# EAGLE design IND_DCDC (EAGLE 5.11)
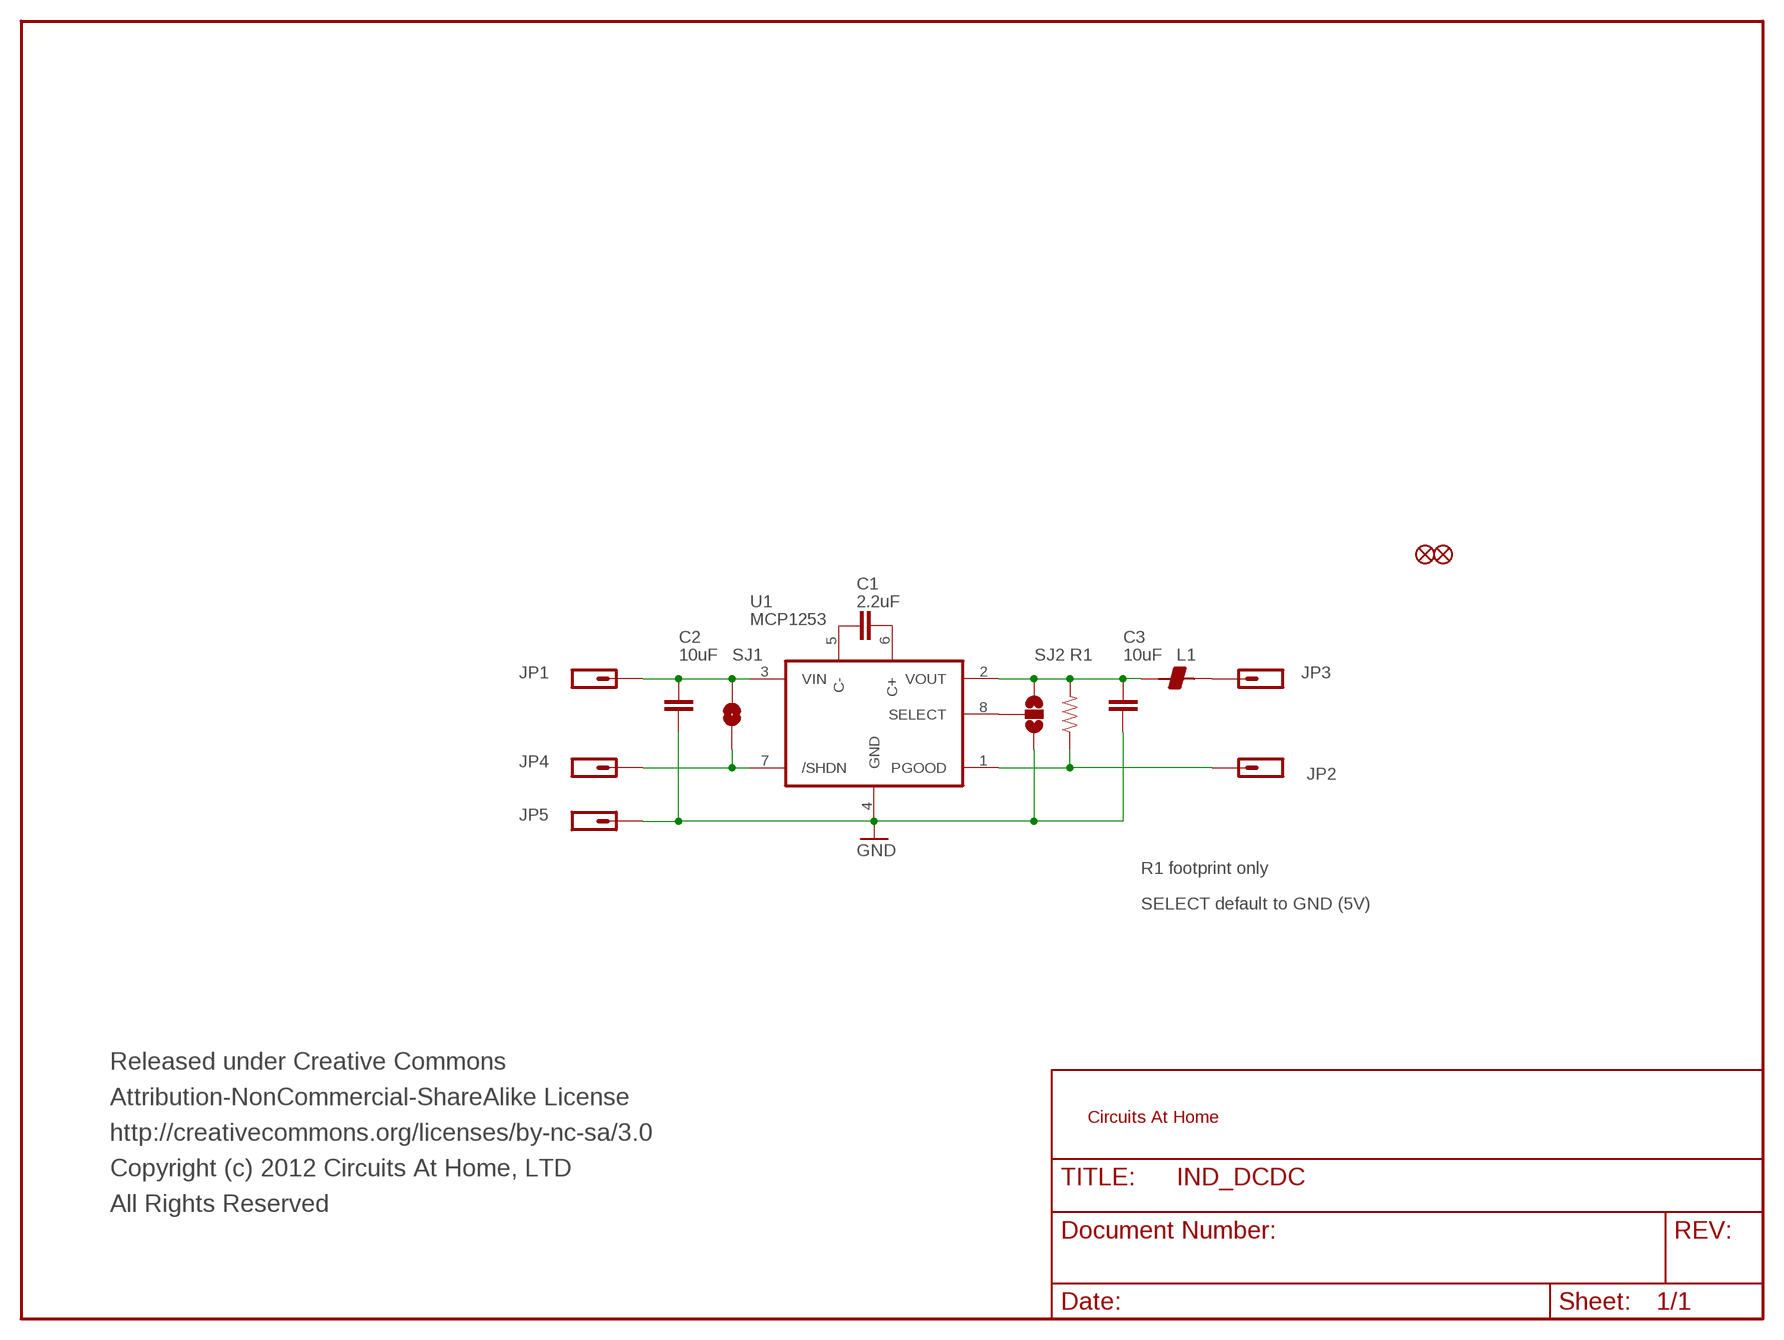
[diagram p0: schematic, sheet 1]

## Parts
C1  2.2uF  CAP0603  [0603]
C2  10uF  CAP0603  [0603]
C3  10uF  CAP0603  [0603]
JP1  M01PTH  [1X01]
JP2  M01PTH  [1X01]
JP3  M01PTH  [1X01]
JP4  M01PTH  [1X01]
JP5  M01PTH  [1X01]
JP6  FIDUCIAL1X2  [FIDUCIAL-1X2]
JP7  FIDUCIAL1X2  [FIDUCIAL-1X2]
L1  BEAD-0805  [0805]
R1  RESISTOR0603  [0603]
SJ1  SOLDERJUMPERTRACE  [SJ_2S-TRACE]
SJ2  SOLDERJUMPER_2WAYPASTE2&3  [SJ_3_PASTE2&3]
U1  MCP1253  [MSOP8]

## Nets
GND: C2.1 C3.1 JP5.1 SJ2.3 U1.4(GND)
N$1: C1.1 U1.5(C-)
N$2: C1.2 U1.6(C+)
N$3: C2.2 JP1.1 SJ1.2 U1.3(VIN)
N$4: JP4.1 SJ1.1 U1.7(/SHDN)
N$5: SJ2.2 U1.8(SELECT)
N$6: C3.2 L1.1 R1.2 SJ2.1 U1.2(VOUT)
N$7: JP2.1 R1.1 U1.1(PGOOD)
N$8: JP3.1 L1.2

## Notes on the sheet
- R1 footprint only
- SELECT default to GND (5V)
- Released under Creative Commons
- Attribution-NonCommercial-ShareAlike License
- http://creativecommons.org/licenses/by-nc-sa/3.0
- Copyright (c) 2012 Circuits At Home, LTD
- All Rights Reserved

## Library data of the parts
C1-C3 = CH_passive:CAP: Capacitor Standard 0603 ceramic capacitor, and 0.1" leaded capacitor.
JP1-JP5 = CH_connectors:M01: Header 1 Standard 1-pin 0.1" header. Use with straight break away headers (SKU : PRT-00116), right angle break away headers (PRT-00553), swiss pins (PRT-00743), machine pins (PRT-00117), and female headers (PRT-00115).
JP6 JP7 = CH_connectors:FIDUCIAL: Fiducial Alignment Points Various fiducial points for machine vision alignment.
L1 = CH_passive:BEAD
R1 = CH_passive:RESISTOR: Resistor Basic schematic elements and footprints for 0603, 1206, and PTH 1/10th watt (small) resistors.
SJ1 = CH_connectors:SOLDERJUMPER: Solder Jumper Standard SMD solder jumper. Used to automate production. Two varients : Normally Open and Normally Closed are the same, but have different paste layers. NC will have a large amount of paste and should jumper during reflow.
SJ2 = CH_connectors:SOLDERJUMPER_2WAY: Solder Jumper 2 way solder jumper
U1 = CH_Microchip:MCP1253

## Board
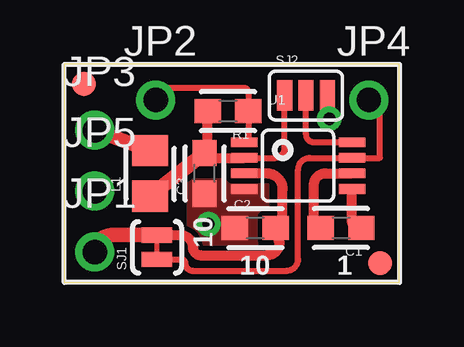
[diagram p1: board, top side]
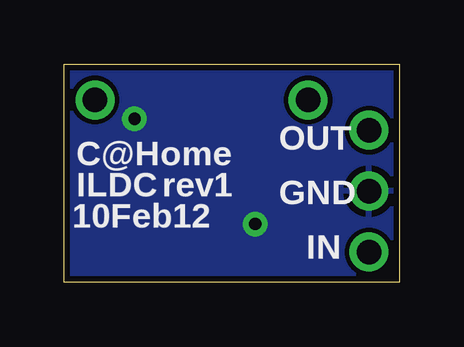
[diagram p2: board, bottom side, seen from below]

Size 13.97 x 9.1 mm. Coordinates in mm from the lower left corner, seen from the top.
Outline: 0,0 13.97,0 13.97,9.1 0,9.1 0,0
Copper layers (1*16): Top 0.035mm / dielectric 1.5mm / Bottom 0.035mm
Design rules "CHome": minimum track width 8mil, minimum drill 20mil, track to track 8mil, track to pad 8mil, pad to pad 8mil, via to via 8mil, smd to smd 8mil, copper to edge 10mil, drill to drill 8mil, minimum pad ring 12mil, minimum via ring 10mil, stop-mask expansion 4mil, vias tented up to drill 20mil, thermal gap 10mil

### Footprints (pad centres in the part's own frame; a part is rotated, then mirrored left to right if it is on the bottom)
0603 = smd 1.1 x 1: 1 -0.85,0; 2 0.85,0
1X01 = drill 1.016 round: 1 0,0
FIDUCIAL-1X2 = smd 1 x 1: 1 0,0
0805 = smd 1.3 x 1.5: 1 -0.95,0; 2 0.95,0
SJ_2S-TRACE = smd 0.635 x 1.27: 1 -0.508,0; 2 0.508,0
SJ_3_PASTE2&3 = smd 0.635 x 1.27: 1 -0.889,0; 2 0,0; 3 0.889,0
MSOP8 = smd 0.4 x 1.1: 1 -0.975,-2.25; 2 -0.325,-2.25; 3 0.325,-2.25; 4 0.975,-2.25; 5 0.975,2.25; 6 0.325,2.25; 7 -0.325,2.25; 8 -0.975,2.25

### Placement (x,y rotation side)
C1  11.54,2.27 180 top
C2  7.96,2.27 0 top
C3  5.85,4.55 90 top
JP1  1.27,1.27 0 top
JP2  3.81,7.62 0 top
JP3  1.27,6.35 0 top
JP4  12.7,7.62 0 top
JP5  1.27,3.81 0 top
JP6  0.81,8.29 0 top
JP7  13.16,0.81 0 top
L1  3.58,4.55 90 top
R1  6.83,7.15 180 top
SJ1  3.86,1.47 90 top
SJ2  10.07,7.8 0 top
U1  9.75,4.88 270 top

### Tracks (layer width: path | path; a pad name or v marks a point on that pad's centre or on a via)
GND  (via drill 0.51)
  Top 0.254: SJ2.3 10.96,6.75 arc90 v11.05,6.83
  other vias: 6.01,2.44
  pour Bottom: 0,9.1 13.97,9.1 13.97,0 0,0
  pour Top (no thermals): 5.2,4.22 5.2,1.62 8.45,1.62 8.45,4.22
N$1
  Top 0.406: U1.5 12,2.5 arc90 C1.1
N$2
  Top 0.406: U1.6 10.89,4.55 arc90 10.4,4.06 10.4,2.4 arc90 C1.2
N$3
  Top 0.406: U1.3 8.45,4.55 arc-90 9.1,3.9 9.1,2.4 arc-90 C2.2 | C2.2 arc-90 9.1,2.15 | SJ1.2 4.85,1.98 arc-90 5.36,1.46 arc90 5.69,1.14 8.45,1.14 arc90 8.97,1.66 C2.2
  Top 0.61: SJ1.2 1.98,1.98 arc90 JP1.1
N$4
  Top 0.254: SJ1.1 4.89,0.96 arc-90 5.04,0.81 arc90 5.36,0.49 9.26,0.49 arc90 9.75,0.97 9.75,4.71 arc-90 10.24,5.2 U1.7 13.16,5.2 13.16,7.16 arc90 JP4.1
N$5
  Top 0.254: SJ2.2 10.07,6.17 arc90 10.4,5.85 U1.8
N$6
  Top 0.254: SJ2.1 9.19,5.61 arc-90 8.78,5.2 U1.2
  Top 0.406: U1.2 6.05,5.2 arc-90 C3.2 arc90 5.97,5.53 R1.2
  Top 0.61: L1.1 C3.2
N$7
  Top 0.254: U1.1 arc90 7.67,6.03 R1.1 7.67,7.92 arc90 7.47,8.12 4.32,8.12 arc90 JP2.1
N$8
  Top 0.61: JP3.1 L1.2

### Text on the board
tPlace: 10 | 10 | 1
bPlace: OUT | C@Home | rev1 | ILDC | GND | 10Feb12 | IN
tDocu: Released under Creative Commons | Attribution-NonCommercial-ShareAlike License | http://creativecommons.org/licenses/by-nc-sa/3.0 | Copyright (c) 2012 Circuits At Home | All Rights Reserved